# EAGLE design facebard-7-sensor-neopixel-ffc (EAGLE 9.6.2)
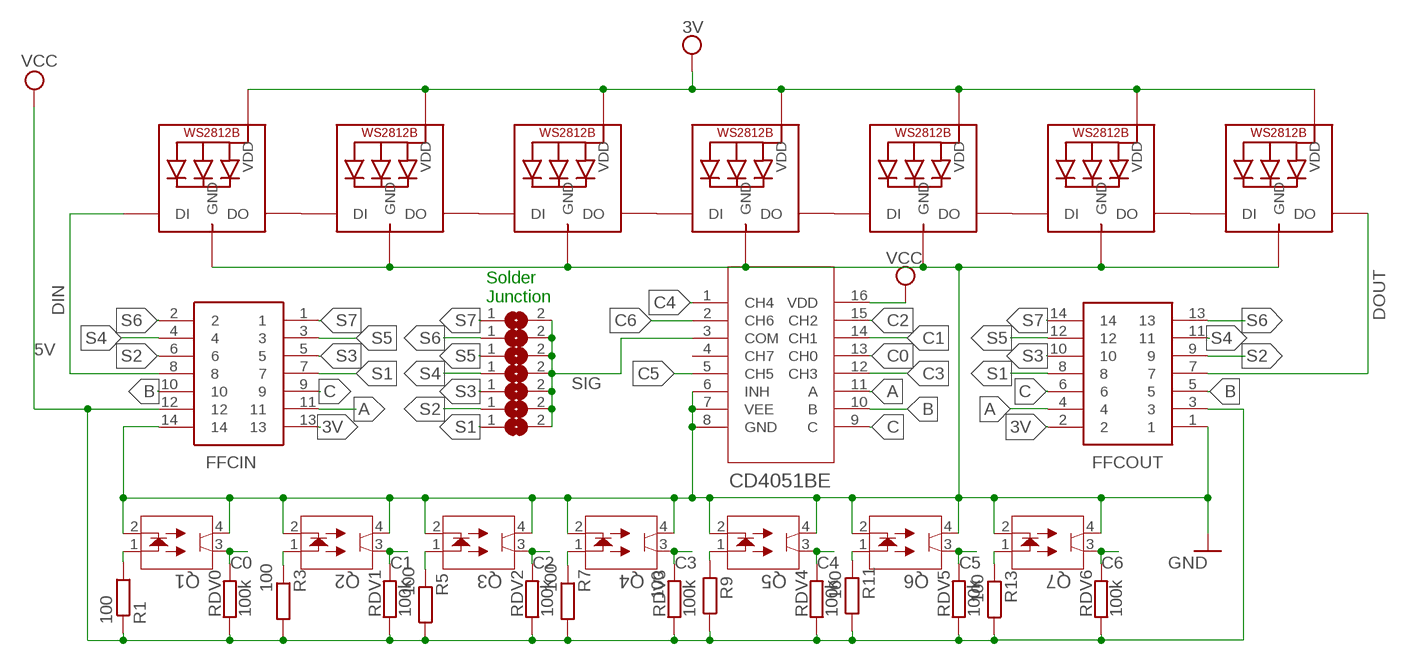
[diagram p0: schematic, sheet 1]

## Parts
FFCIN  52806-1410  [528061410]
FFCOUT  52806-1410  [528061410]
LED1  WS2812B3535  [LED3535]
LED2  WS2812B3535  [LED3535]
LED3  WS2812B3535  [LED3535]
LED4  WS2812B3535  [LED3535]
LED5  WS2812B3535  [LED3535]
LED6  WS2812B3535  [LED3535]
LED7  WS2812B3535  [LED3535]
Q1  QRE1113  [DIP4_100AQ_ONS]
Q2  QRE1113  [DIP4_100AQ_ONS]
Q3  QRE1113  [DIP4_100AQ_ONS]
Q4  QRE1113  [DIP4_100AQ_ONS]
Q5  QRE1113  [DIP4_100AQ_ONS]
Q6  QRE1113  [DIP4_100AQ_ONS]
Q7  QRE1113  [DIP4_100AQ_ONS]
R1  100  R-EU_0207/10  [0207/10]
R3  100  R-EU_0207/10  [0207/10]
R5  100  R-EU_0207/10  [0207/10]
R7  100  R-EU_0207/10  [0207/10]
R9  100  R-EU_0207/10  [0207/10]
R11  100  R-EU_0207/10  [0207/10]
R13  100  R-EU_0207/10  [0207/10]
RDV0  100k  R-EU_0207/10  [0207/10]
RDV1  100k  R-EU_0207/10  [0207/10]
RDV2  100k  R-EU_0207/10  [0207/10]
RDV3  100k  R-EU_0207/10  [0207/10]
RDV4  100k  R-EU_0207/10  [0207/10]
RDV5  100k  R-EU_0207/10  [0207/10]
RDV6  100k  R-EU_0207/10  [0207/10]
SJ1  SJ  [SJ]
SJ2  SJ  [SJ]
SJ3  SJ  [SJ]
SJ4  SJ  [SJ]
SJ5  SJ  [SJ]
SJ6  SJ  [SJ]
SJ7  SJ  [SJ]
U1  CD4051BE  [N16]

## Nets
3V: FFCIN.13 FFCOUT.2 LED1.2(VDD) LED2.2(VDD) LED3.2(VDD) LED4.2(VDD) LED5.2(VDD) LED6.2(VDD) LED7.2(VDD)
5V: FFCIN.12 FFCOUT.3 R1.1 R3.1 R5.1 R7.1 R9.1 R11.1 R13.1 RDV0.1 RDV1.1 RDV2.1 RDV3.1 RDV4.1 RDV5.1 RDV6.1 U1.16(VDD) ; supply symbol labelled VCC
A: FFCIN.11 FFCOUT.4 U1.11(A)
B: FFCIN.10 FFCOUT.5 U1.10(B)
C: FFCIN.9 FFCOUT.6 U1.9(C)
C0: Q1.3 RDV0.2 U1.13(CH0)
C1: Q2.3 RDV1.2 U1.14(CH1)
C2: Q3.3 RDV2.2 U1.15(CH2)
C3: Q4.3 RDV3.2 U1.12(CH3)
C4: Q5.3 RDV4.2 U1.1(CH4)
C5: Q6.3 RDV5.2 U1.5(CH5)
C6: Q7.3 RDV6.2 U1.2(CH6)
DIN: FFCIN.8 LED1.1(DI)
DOUT: FFCOUT.7 LED7.3(DO)
GND: FFCIN.14 FFCOUT.1 LED1.4(GND) LED2.4(GND) LED3.4(GND) LED4.4(GND) LED5.4(GND) LED6.4(GND) LED7.4(GND) Q1.2 Q1.4 Q2.2 Q2.4 Q3.2 Q3.4 Q4.2 Q4.4 Q5.2 Q5.4 Q6.2 Q6.4 Q7.2 Q7.4 U1.6(INH) U1.7(VEE) U1.8(GND)
N$1: Q1.1 R1.2
N$3: Q2.1 R3.2
N$4: LED1.3(DO) LED2.1(DI)
N$5: Q3.1 R5.2
N$6: LED2.3(DO) LED3.1(DI)
N$7: Q4.1 R7.2
N$8: LED3.3(DO) LED4.1(DI)
N$9: LED4.3(DO) LED5.1(DI)
N$10: LED5.3(DO) LED6.1(DI)
N$11: Q6.1 R11.2
N$12: LED6.3(DO) LED7.1(DI)
N$13: Q7.1 R13.2
N$14: Q5.1 R9.2
S1: FFCIN.7 FFCOUT.8 SJ1.1
S2: FFCIN.6 FFCOUT.9 SJ2.1
S3: FFCIN.5 FFCOUT.10 SJ3.1
S4: FFCIN.4 FFCOUT.11 SJ4.1
S5: FFCIN.3 FFCOUT.12 SJ5.1
S6: FFCIN.2 FFCOUT.13 SJ6.1
S7: FFCIN.1 FFCOUT.14 SJ7.1
SIG: SJ1.2 SJ2.2 SJ3.2 SJ4.2 SJ5.2 SJ6.2 SJ7.2 U1.3(COM)
Unconnected: U1.4(CH7)

## Notes on the sheet
- Solder
  Junction

## Library data of the parts
FFCIN FFCOUT = 52806-1410:52806-1410: Molex 2mm Pitch 14 Way Straight Female FPC Connector Source: Datasheet <https://tools.molex.com/pdm_docs/sd/528060410_sd.pdf>; DESCRIPTION: Molex 2mm Pitch 14 Way Straight Female FPC Connector; HEIGHT: 5.6mm; MANUFACTURER_NAME: Molex; MANUFACTURER_PART_NUMBER: 52806-1410; MOUSER_PART_NUMBER: 538-52806-1410; MOUSER_PRICE-STOCK: https://www.mouser.co.uk/ProductDetail/Molex/52806-1410?qs=%252BdbFUiYBkDYU5moeZz2crA%3D%3D
LED1-LED7 = adafruit:WS2812B
Q1-Q7 = qre1113:QRE1113; COPYRIGHT: Copyright (C) 2024 Ultra Librarian. All rights reserved.; MANUFACTURER_PART_NUMBER: QRE1113; MFR_NAME: onsemi
R1 R3 R5 R7 R9 R11 R13 RDV0 RDV1-RDV6 = rcl:R-EU_: RESISTOR, European symbol; SPICEPREFIX: R
SJ1-SJ7 = jumper:SJ: SMD solder JUMPER
U1 = CD4051BE:CD4051BE; COPYRIGHT: Copyright (C) 2024 Ultra Librarian. All rights reserved.; MANUFACTURER_PART_NUMBER: CD4051BE; MFR_NAME: Texas Instruments

## Board
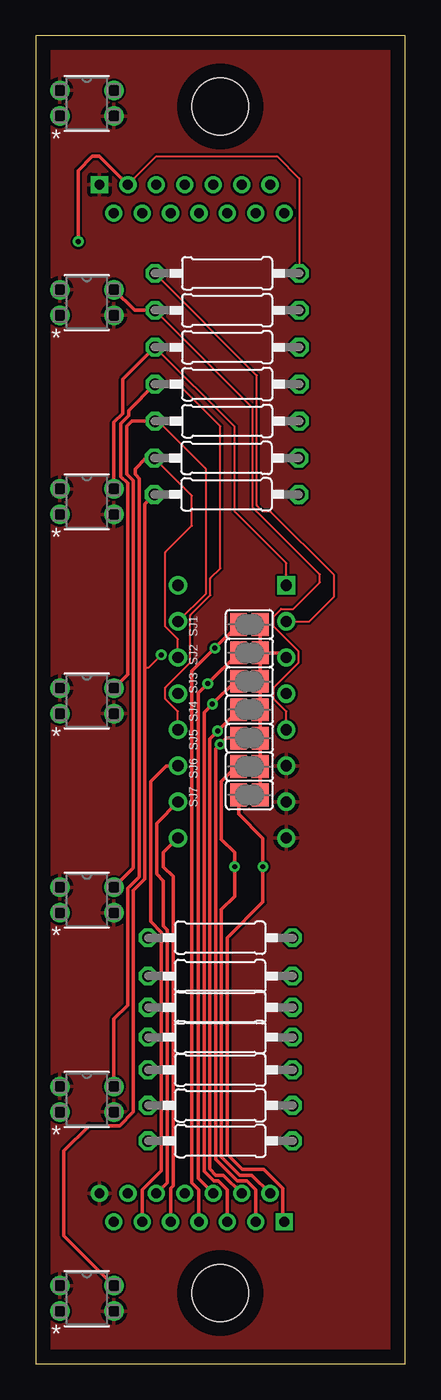
[diagram p1: board, top side]
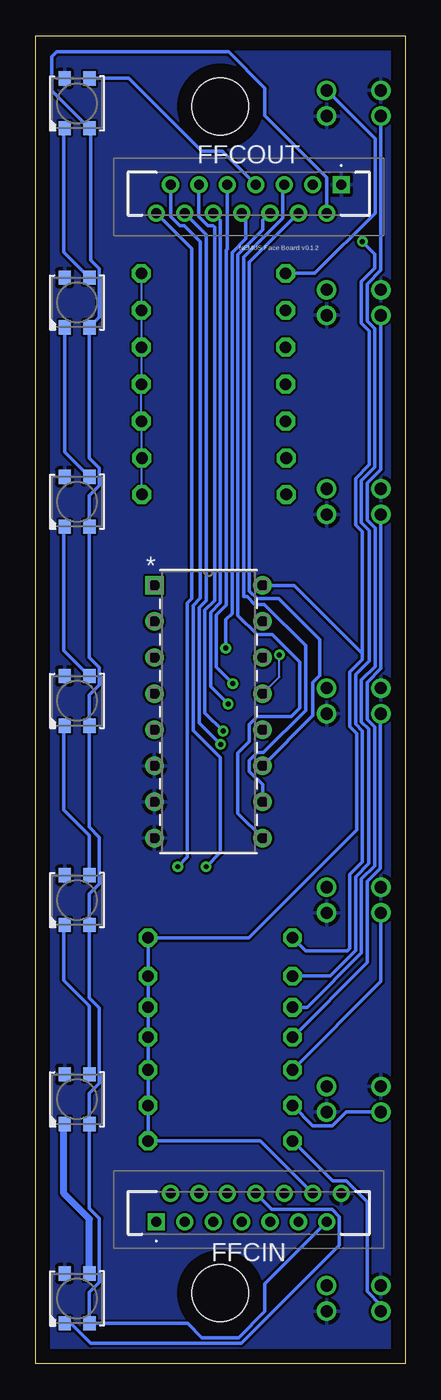
[diagram p2: board, bottom side, seen from below]

Size 26 x 93.5 mm. Coordinates in mm from the lower left corner, seen from the top.
Outline: 0,0 26,0 26,93.5 0,93.5 0,0
Copper layers (1*16): Top 0.035mm / dielectric 1.5mm / Bottom 0.035mm
Design rules "default": minimum track width 6mil, minimum drill 0.35mm, track to track 6mil, track to pad 6mil, pad to pad 6mil, via to via 6mil, smd to smd 6mil, copper to edge 40mil, drill to drill 6mil, minimum pad ring 10mil, minimum via ring 8mil, stop-mask expansion 4mil, vias tented up to drill 0mil, thermal gap 10mil
Holes 4 mm at 13,5 13,88.5

### Footprints (pad centres in the part's own frame; a part is rotated, then mirrored left to right if it is on the bottom)
528061410 = drill 0.7 pad 1.2 square: 1 0,0 | drill 0.7 pad 1.2: 2 1,2; 3 2,0; 4 3,2; 5 4,0; 6 5,2; 7 6,0; 8 7,2; 9 8,0; 10 9,2; 11 10,0; 12 11,2; 13 12,0; 14 13,2
LED3535 = smd 1 x 0.85: 1 -1.75,0.875; 2 -1.75,-0.875; 3 1.75,-0.875; 4 1.75,0.875
DIP4_100AQ_ONS = drill 0.864 pad 1.372: 1 0,0; 2 3.81,0; 3 3.81,1.803; 4 0,1.803
0207/10 = drill 0.813 octagon: 1 -5.08,0; 2 5.08,0
SJ = smd 1.168 x 1.6: 1 -0.762,0; 2 0.762,0
N16 = drill 0.787 pad 1.295 square: 1 0,0 | drill 0.787 pad 1.295: 2 0,-2.54; 3 0,-5.08; 4 0,-7.62; 5 0,-10.16; 6 0,-12.7; 7 0,-15.24; 8 0,-17.78; 9 7.62,-17.78; 10 7.62,-15.24; 11 7.62,-12.7; 12 7.62,-10.16; 13 7.62,-7.62; 14 7.62,-5.08; 15 7.62,-2.54; 16 7.62,0

### Placement (x,y rotation side)
FFCIN  17.5,10 0 bottom
FFCOUT  4.5,83 180 bottom
LED1  23.08,4.61 90 bottom
LED2  23.08,18.63 90 bottom
LED3  23.08,32.65 90 bottom
LED4  23.08,46.67 90 bottom
LED5  23.08,60.69 90 bottom
LED6  23.08,74.71 90 bottom
LED7  23.08,88.73 90 bottom
Q1  1.71,3.71 0 top
Q2  1.71,17.73 0 top
Q3  1.71,31.75 0 top
Q4  1.71,45.77 0 top
Q5  1.71,59.79 0 top
Q6  1.71,73.81 0 top
Q7  1.71,87.83 0 top
R1  13,15.7 180 top
R3  13,18.2 180 top
R5  13,20.7 180 top
R7  13,23 180 top
R9  13,25.1 180 top
R11  13,27.3 180 top
R13  13,30 180 top
RDV0  13.44,61.2 180 top
RDV1  13.44,63.76 180 top
RDV2  13.48,66.36 180 top
RDV3  13.48,68.96 180 top
RDV4  13.48,71.56 180 top
RDV5  13.48,74.16 180 top
RDV6  13.48,76.76 180 top
SJ1  15.05,52.05 0 top
SJ2  15.05,50.05 0 top
SJ3  15.05,48.05 0 top
SJ4  15.05,46.05 0 top
SJ5  15.05,44.05 0 top
SJ6  15.05,42.05 0 top
SJ7  15.05,40.05 0 top
U1  17.64,54.8 0 bottom

### Tracks (layer width: path | path; a pad name or v marks a point on that pad's centre or on a via)
3V
  Bottom 0.254: FFCOUT.2 5.5,83.5 9.86,87.86 9.86,89.8 12.41,92.36 24.5,92.36 24.86,92 24.86,89.63 LED7.2 22.12,86.9 22.12,77.7 21.5,77.08 21.5,73.66 LED6.2 22.2,63.76 21.5,63.06 21.5,61.82 22.2,61.12 LED5.2 22.2,49.74 21.5,49.04 21.5,47.8 22.2,47.1 LED4.2 22.2,37.78 21.5,37.08 21.5,33.78 22.2,33.08 LED3.2 22.2,25.78 21.5,25.07 21.5,19.76 22.2,19.06 LED2.2 22.2,10.96 21.5,10.26 21.5,5.74 22.2,5.04 LED1.2 15.3,2.86 14.3,1.86 11.7,1.86 9.86,3.7 9.86,5.64 FFCIN.13
5V  (via drill 0.35)
  Top 0.152: FFCOUT.3 8.5,85 17,85 18.56,83.44 RDV6.1
  Top 0.254: v3,79 3,84 4,85 4.5,85 FFCOUT.3
  Bottom 0.152: RDV6.1 RDV5.1 RDV4.1 RDV3.1 RDV2.1 18.52,66.32 RDV1.1 RDV0.1
  Bottom 0.254: FFCIN.12 10.2,15.7 R1.1 R3.1 R5.1 R7.1 R9.1 R11.1 R13.1 11,30 3.41,37.59 3.41,44.38 3.89,44.87 3.89,48.69 3,49.58 3,50 | 3,50 7.8,54.8 U1.16 | 3,50 3,58.57 3.48,59.05 3.48,62.33 2.52,63.29 2.52,72.69 3.08,73.24 3.08,76.18 2.13,77.13 2.13,78.13 v3,79
A
  Top 0.254: U1.11 9.21,42.1 8.11,41 8.11,31.14 8.86,30.39 8.86,13.61 7.5,12.25 FFCIN.11
  Bottom 0.254: FFCOUT.4 10.95,77.55 10.95,54.42 10.4,53.87 8.87,53.87 6,51 6,48.45 6.48,47.97 6.48,45.64 U1.11
B
  Top 0.254: U1.10 8.51,38.05 8.51,34.49 9,34 9,30.82 9.27,30.56 9.27,12.77 FFCIN.10
  Bottom 0.254: FFCOUT.5 8.62,82.88 8.62,80.63 11.35,77.9 11.35,54 11.11,54 10.57,53.47 9.91,53.47 7,50.55 7,46 9.97,43.03 10.4,43.03 10.95,42.48 10.95,41.72 10.02,40.79 U1.10
C
  Top 0.254: FFCIN.9 9.5,12.38 9.67,12.55 9.67,34.33 9,35 9,36 U1.9
  Bottom 0.254: FFCOUT.6 10,80.5 10,79.83 11.76,78.07 11.76,52.69 10.4,51.33 9.33,51.33 7.41,49.41 7.41,46.17 8.01,45.57 10.4,45.57 10.95,45.02 10.95,43.81 11.76,43 11.76,38.76 U1.9
C0  (via drill 0.35)
  Top 0.152: v8.84,49.91 7.93,49 7.7,49
  Top 0.254: Q1.3 2,9.03 2,15 3.77,16.77 5.92,16.77 6.89,17.74 6.89,33.31 7.7,34.12 7.7,49 7.7,60.54 RDV0.2
  Bottom 0.152: U1.13 8.84,48.36 v8.84,49.91
C1
  Top 0.152: U1.14 10.02,51.02 9.14,51.9 9.14,57.14 11,59 11,61.12 RDV1.2
  Top 0.254: Q2.3 5.51,24.28 6.48,25.24 6.48,33.48 7.29,34.29 7.29,62.33 7,62.62 7,63 7.76,63.76 RDV1.2
C2
  Top 0.152: U1.15 12,54.24 12,63 8.64,66.36 8,66.36
  Top 0.254: Q3.3 6.89,34.92 6.89,62.16 6.41,62.64 6.41,66 6.77,66.36 8,66.36 RDV2.2
C3
  Top 0.152: U1.12 10.02,45.94 9.14,46.82 9.14,47.6 10.9,49.36 10.9,52.7 12.3,54.11 12.3,55.3 13,56 13,66 10,69 8.44,69 RDV3.2
  Top 0.254: Q4.3 6.48,48.54 6.48,61.99 6,62.47 6,66.19 6.55,66.74 6.55,67.11 RDV3.2
C4
  Top 0.152: U1.1 17.64,56.36 14,60 14,65.96 RDV4.2
  Top 0.254: Q5.3 5.51,66.28 6.14,66.91 6.14,69.3 RDV4.2
C5
  Top 0.152: U1.5 17.64,45.94 16.76,46.82 16.76,47.6 18.52,49.36 18.52,50.14 16.76,51.9 16.76,52.62 17.28,53.14 18.14,53.14 20,55 20,55.57 15.28,60.29 15.28,67.28 RDV5.2
  Top 0.254: Q6.3 6.97,74.16 RDV5.2
C6
  Top 0.152: RDV6.2 15.58,69.58 15.58,60.42 16,60 16.52,60 21,55.52 21,54 19.26,52.26 U1.2
  Bottom 0.254: RDV6.2 6.35,76.76 2.11,81 2.11,86.23 Q7.3
DIN
  Bottom 0.254: LED1.1 23.52,2.86 22.12,1.45 11.53,1.45 4.62,8.36 4.62,10.37 5.13,10.88 5.87,10.88 9.38,10.88 FFCIN.8
DOUT
  Bottom 0.254: FFCOUT.7 12.86,85.36 14.3,85.36 19.43,90.48 LED7.3
GND
  pour Top: 0,93.5 26,93.5 26,0 0,0
  pour Bottom: 26,93.5 0,93.5 0,0 26,0
N$1
  Bottom 0.254: R1.2 5.1,12.88 4.13,12.88 2.67,11.42 2.67,5.11 1.71,4.15 Q1.1
N$3
  Bottom 0.254: Q2.1 4.15,17.73 5.12,16.77 6.49,16.77 R3.2
N$4
  Bottom 0.508: LED1.3 22.2,10.21 24,12 24,16.84 LED2.1
N$5
  Bottom 0.254: R5.2 1.71,26.91 Q3.1
N$6
  Bottom 0.254: LED2.3 22.2,25.2 24,27 24,30.86 LED3.1
N$7
  Bottom 0.254: Q4.1 1.74,45.74 1.74,34.89 2.67,33.95 2.67,28.25 R7.2
N$8
  Bottom 0.254: LED3.3 22.2,37.2 24,39 24,44.88
  Bottom 0.508: 24,44.88 LED4.1
N$9
  Bottom 0.254: LED4.3 24,50.22 24,58.9
  Bottom 0.508: 24,58.9 LED5.1
N$10
  Bottom 0.254: LED5.3 23.95,64.19 LED6.1
N$11
  Bottom 0.254: R11.2 5.28,27.3 3.48,29.09 3.48,34.29 2.55,35.22 2.55,44.68 3.08,45.2 3.08,48.14 2.11,49.11 2.11,58.83 2.67,59.39 2.67,61.99 1.71,62.96 Q6.1
N$12
  Bottom 0.254: LED6.3 24,78.25 24,86.94
  Bottom 0.508: 24,86.94 LED7.1
N$13
  Bottom 0.254: R13.2 7,29.07 4.08,29.07 3.89,29.26 3.89,34.46 3,35.35 3,44.55 3.48,45.03 3.48,48.52 2.52,49.48 2.52,58.66 3.08,59.22 3.08,62.16 2.12,63.12 2.12,72.86 2.67,73.41 2.67,76.01 1.71,76.98 Q7.1
N$14
  Bottom 0.254: R9.2 6.9,25.1 3.08,28.92 3.08,34.12 2.14,35.05 2.14,44.84 2.67,45.37 2.67,47.97 1.71,48.94 Q5.1
S1  (via drill 0.35)
  Top 0.254: FFCIN.7 11.5,12.25 11,12.75 11,48.76 v12.62,50.38 SJ1.1
  Bottom 0.254: v12.62,50.38 12.62,52.38 12.17,52.83 12.17,78.23 11.2,79.2 11.2,80.7 FFCOUT.8
S2  (via drill 0.35)
  Top 0.254: FFCIN.6 11.45,13.05 11.45,47.21 v12.12,47.88 SJ2.1
  Bottom 0.254: FFCOUT.9 12.5,78.47 12.57,78.4 12.57,53.43 13.28,52.72 13.28,49.04 v12.12,47.88
S3  (via drill 0.35)
  Top 0.254: FFCIN.5 13.5,12.25 12.87,12.88 12.52,12.88 11.86,13.55 11.86,45.86 v12.45,46.45 14.05,48.05 SJ3.1
  Bottom 0.254: v12.45,46.45 13.68,47.68 13.68,52.89 13,53.58 13,80.5 FFCOUT.10
S4  (via drill 0.35)
  Top 0.254: FFCIN.4 13.21,13.29 12.69,13.29 12.26,13.72 12.26,44 v12.81,44.54 14.29,46.02 SJ4.1
  Bottom 0.254: FFCOUT.11 14.5,80.75 13.87,80.12 13.52,80.12 13.41,80 13.41,53.74 14.09,53.06 14.09,45.83 v12.81,44.54
S5  (via drill 0.35)
  Top 0.254: FFCIN.3 15.5,12.25 14.87,12.88 14.19,12.88 12.67,14.41 12.67,43.3 v12.98,43.62 13.42,44.05 SJ5.1
  Bottom 0.254: v12.98,43.62 14.5,45.13 14.5,53.23 14,53.72 14,79.5 FFCOUT.12
S6  (via drill 0.35)
  Top 0.254: FFCIN.2 15.21,13.29 14.36,13.29 13.08,14.57 13.08,32 14,32.92 v14,35 14,36 13.08,36.92 13.08,41 14.13,42.05 SJ6.1
  Bottom 0.254: FFCOUT.13 16.5,80.75 15.87,80.12 15.52,80.12 14.41,79 14.41,53.89 14.9,53.4 14.9,44.6 13,42.7 13,36 v14,35
S7  (via drill 0.35)
  Top 0.254: FFCIN.1 17.38,10.12 17.38,12.37 16.05,13.7 14.53,13.7 13.48,14.74 13.48,30 16,32.52 v16,35 16,37 14.29,38.71 SJ7.1
  Bottom 0.254: FFCOUT.14 15,78.5 15,53.87 15.31,53.56 15.31,35.69 v16,35
SIG
  Top 0.254: SJ7.2 SJ6.2 SJ5.2 SJ4.2 SJ3.2 SJ2.2 | SJ2.2 SJ1.2 | SJ2.2 17.31,50.05 U1.3

### Text on the board
bNames: NEMUS Face Board v0.1.2